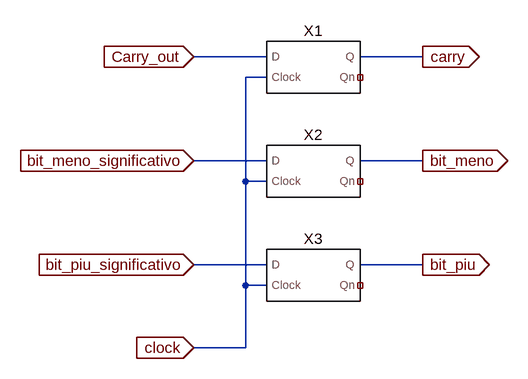
[diagram p0: schematic masterslave_3bit.asc]
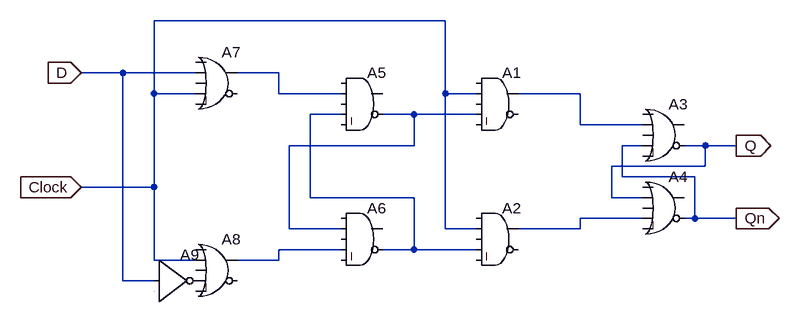
[diagram p1: sub-circuit masterslave.asc]
masterslave_3bit.asc, the LTspice schematic file:
Version 4
SHEET 1 880 680
WIRE 144 80 32 80
WIRE 384 80 288 80
WIRE 144 112 112 112
WIRE 144 240 32 240
WIRE 384 240 288 240
WIRE 112 272 112 112
WIRE 144 272 112 272
WIRE 144 400 32 400
WIRE 384 400 288 400
WIRE 112 432 112 272
WIRE 144 432 112 432
WIRE 112 528 112 432
WIRE 112 528 32 528
FLAG 32 80 Carry_out
IOPIN 32 80 In
FLAG 32 240 bit_meno_significativo
IOPIN 32 240 In
FLAG 32 400 bit_piu_significativo
IOPIN 32 400 In
FLAG 384 240 bit_meno
IOPIN 384 240 Out
FLAG 384 400 bit_piu
IOPIN 384 400 Out
FLAG 384 80 carry
IOPIN 384 80 Out
FLAG 32 528 clock
IOPIN 32 528 In
SYMBOL masterslave 208 96 R0
SYMATTR InstName X1
SYMBOL masterslave 208 256 R0
SYMATTR InstName X2
SYMBOL masterslave 208 416 R0
SYMATTR InstName X3

masterslave.asc, the sub-circuit schematic file:
Version 4
SHEET 1 880 680
WIRE -16 -32 -464 -32
WIRE -512 48 -576 48
WIRE -400 48 -512 48
WIRE -272 48 -336 48
WIRE -464 80 -464 -32
WIRE -400 80 -464 80
WIRE -272 80 -272 48
WIRE -176 80 -272 80
WIRE -16 80 -16 -32
WIRE 32 80 -16 80
WIRE 192 80 96 80
WIRE -176 112 -224 112
WIRE -64 112 -112 112
WIRE 32 112 -64 112
WIRE 192 128 192 80
WIRE 288 128 192 128
WIRE -64 160 -64 112
WIRE -64 160 -256 160
WIRE 288 160 256 160
WIRE 384 160 352 160
WIRE 432 160 384 160
WIRE 384 192 384 160
WIRE 384 192 240 192
WIRE 256 208 256 160
WIRE 368 208 256 208
WIRE -464 224 -464 80
WIRE -464 224 -576 224
WIRE -224 240 -224 112
WIRE -64 240 -224 240
WIRE 240 240 240 192
WIRE 288 240 240 240
WIRE 288 272 192 272
WIRE 368 272 368 208
WIRE 368 272 352 272
WIRE 432 272 368 272
WIRE -256 288 -256 160
WIRE -176 288 -256 288
WIRE -16 288 -16 80
WIRE 32 288 -16 288
WIRE 192 288 192 272
WIRE 192 288 96 288
WIRE -176 320 -272 320
WIRE -64 320 -64 240
WIRE -64 320 -112 320
WIRE 32 320 -64 320
WIRE -464 336 -464 224
WIRE -400 336 -464 336
WIRE -272 336 -272 320
WIRE -272 336 -336 336
WIRE -512 368 -512 48
WIRE -464 368 -512 368
FLAG 432 160 Q
IOPIN 432 160 Out
FLAG 432 272 Qn
IOPIN 432 272 Out
FLAG -576 48 D
IOPIN -576 48 In
FLAG -576 224 Clock
IOPIN -576 224 In
SYMBOL Digital\\and 64 32 R0
SYMATTR InstName A1
SYMBOL Digital\\and 64 240 R0
SYMATTR InstName A2
SYMBOL Digital\\or 320 80 R0
SYMATTR InstName A3
SYMBOL Digital\\or 320 192 R0
SYMATTR InstName A4
SYMBOL Digital\\and -144 32 R0
SYMATTR InstName A5
SYMBOL Digital\\and -144 240 R0
SYMATTR InstName A6
SYMBOL Digital\\or -368 0 R0
SYMATTR InstName A7
SYMBOL Digital\\or -368 288 R0
SYMATTR InstName A8
SYMBOL Digital\\inv -464 304 R0
SYMATTR InstName A9

The netlist it stands for:
* masterslave_3bit.asc
XX1 clock Carry_out carry NC_01 masterslave
XX2 clock bit_meno_significativo bit_meno NC_02 masterslave
XX3 clock bit_piu_significativo bit_piu NC_03 masterslave

* block symbol definitions
.subckt masterslave Clock D Q Qn
A1 0 Clock 0 N004 0 0 N002 0 AND
A2 0 Clock 0 N003 0 0 N005 0 AND
A3 0 N002 0 Qn 0 Q 0 0 OR
A4 0 Q 0 N005 0 Qn 0 0 OR
A5 0 N001 0 N003 0 N004 0 0 AND
A6 0 N004 0 N006 0 N003 0 0 AND
A7 0 D 0 Clock 0 0 N001 0 OR
A8 0 Clock 0 P001 0 0 N006 0 OR
A9 D 0 0 0 0 P001 0 0 BUF
.ends masterslave

.backanno
.end